# EAGLE schematic tone control - baxandall (EAGLE 6.5.0)
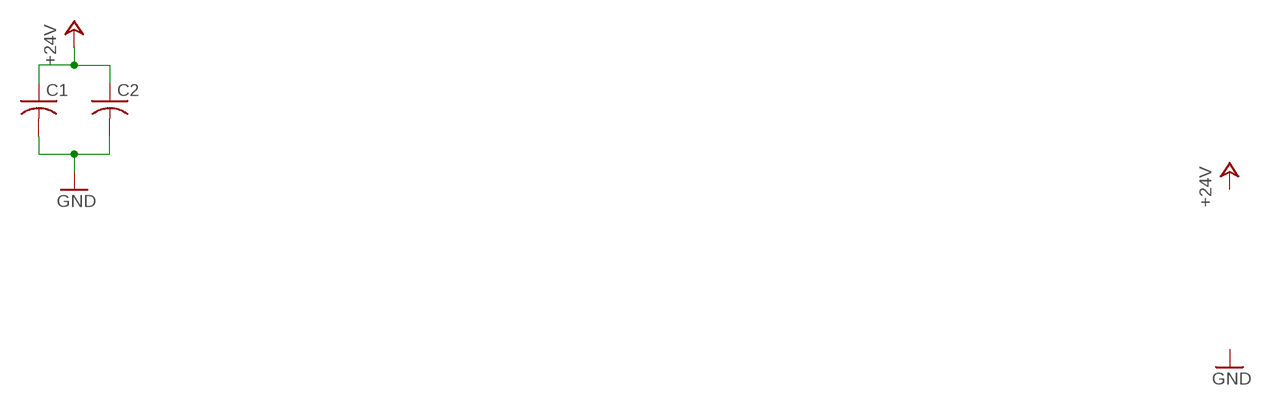
[diagram p0: schematic, sheet 1]

## Parts
C1  C-USC1206K  [C1206K]
C2  C-USC1206K  [C1206K]

## Nets
+24V: C1.1 C2.1
GND: C1.2 C2.2

## Library data of the parts
C1 C2 = rcl:C-US: CAPACITOR, American symbol